# Altium schematic sheet USB2JTAG-MCU.SchDoc: =ProjectTitle+'-MCU'
size A4; SheetNumber: 2; SheetTotal: 3
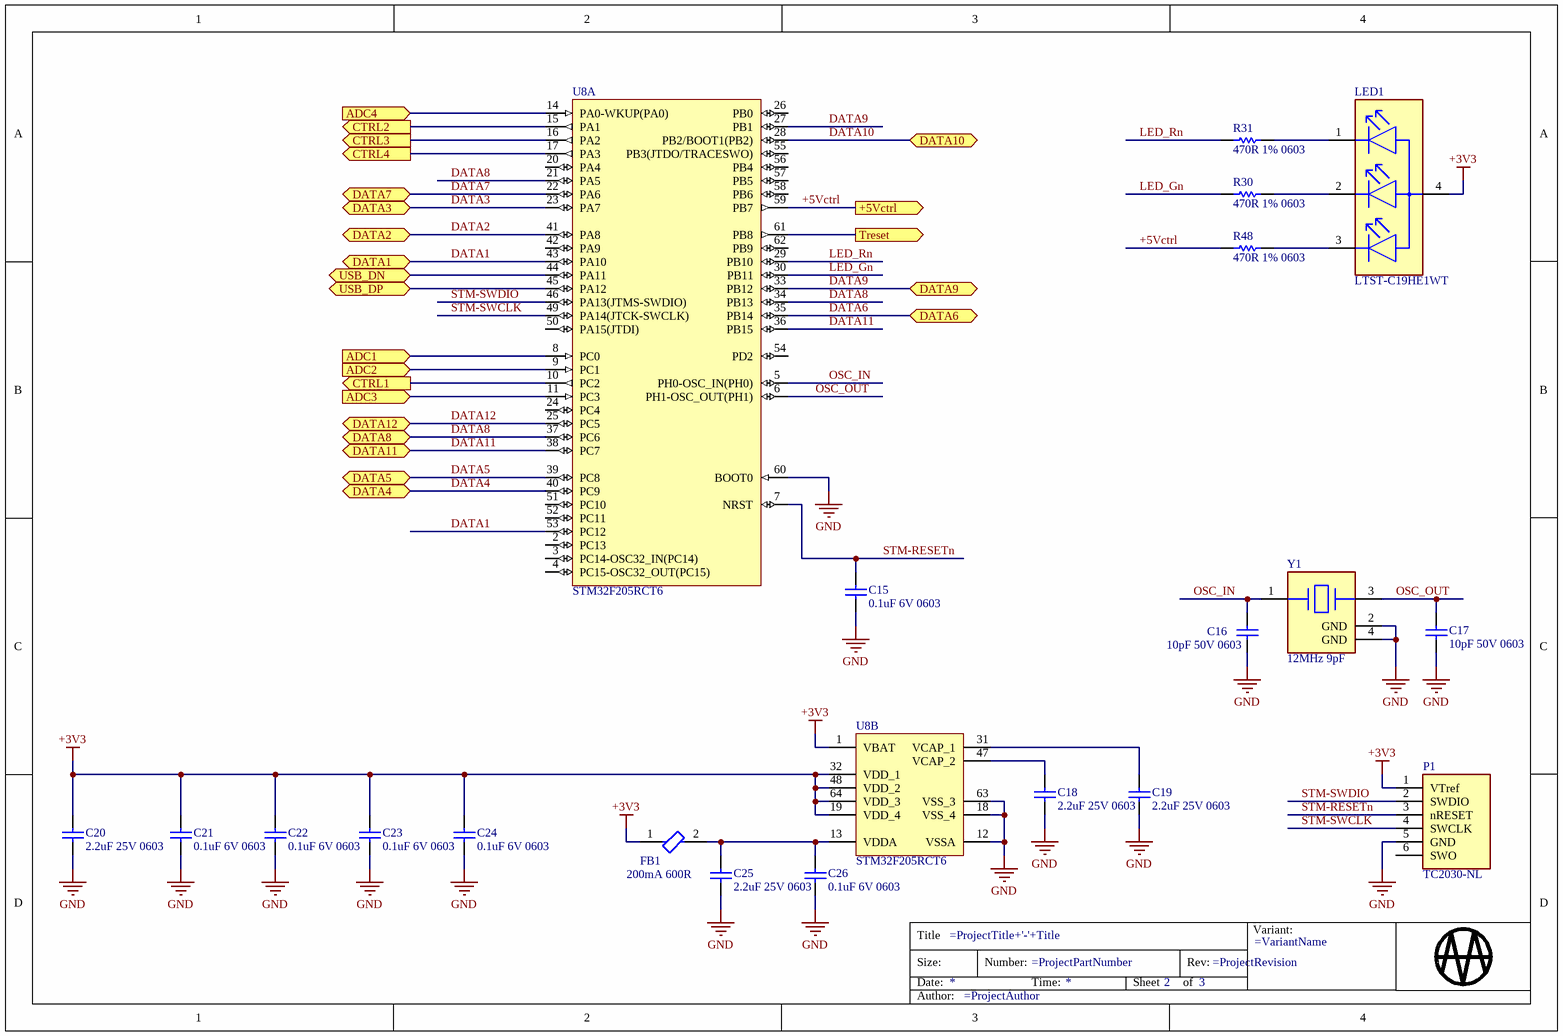
[diagram p0: USB2JTAG-MCU.SchDoc]

## Parts
?  Total Sheets: 3  Sheet Number: 2  (hidden comment: Title Block Logo)  (graphical)
C15  0.1uF 6V 0603  [FP-GRM188-0_1-e0_2_0_55-IPC_C-NOSILK]
C16  10pF 50V 0603  [FP-GRM188-0_1-e0_2_0_55-IPC_C-NOSILK]
C17  10pF 50V 0603  [FP-GRM188-0_1-e0_2_0_55-IPC_C-NOSILK]
C18  2.2uF 25V 0603  [FP-GRM188-0_1-e0_2_0_55-IPC_C-NOSILK]
C19  2.2uF 25V 0603  [FP-GRM188-0_1-e0_2_0_55-IPC_C-NOSILK]
C20  2.2uF 25V 0603  [FP-GRM188-0_1-e0_2_0_55-IPC_C-NOSILK]
C21  0.1uF 6V 0603  [FP-GRM188-0_1-e0_2_0_55-IPC_C-NOSILK]
C22  0.1uF 6V 0603  [FP-GRM188-0_1-e0_2_0_55-IPC_C-NOSILK]
C23  0.1uF 6V 0603  [FP-GRM188-0_1-e0_2_0_55-IPC_C-NOSILK]
C24  0.1uF 6V 0603  [FP-GRM188-0_1-e0_2_0_55-IPC_C-NOSILK]
C25  2.2uF 25V 0603  [FP-GRM188-0_1-e0_2_0_55-IPC_C-NOSILK]
C26  0.1uF 6V 0603  [FP-GRM188-0_1-e0_2_0_55-IPC_C-NOSILK]
FB1  200mA 600R  [FP-BLM18-0_15-t0_8-IPC_C]
LED1  LTST-C19HE1WT  [FP-LTST-C19HE1WT-MFG]
P1  TC2030-NL  [TC2030-NL]  (no BOM)
R30  470R 1% 0603  [FP-ERA3A-IPC_C-NOSILK]
R31  470R 1% 0603  [FP-ERA3A-IPC_C-NOSILK]
R48  470R 1% 0603  [FP-ERA3A-IPC_C-NOSILK]
U8  STM32F205RCT6  [STM-LQFP64_V]  (parts A,B of 2)
Y1  12MHz 9pF  [FP-TSX-3225-MFG]

## Ports
+5Vctrl (out), ADC1 (in), ADC2 (in), ADC3 (in), ADC4 (in), CTRL1 (out), CTRL2 (out), CTRL3 (out), CTRL4 (out), DATA1 (bidir), DATA2 (bidir), DATA3 (bidir), DATA4 (bidir), DATA5 (bidir), DATA6 (bidir), DATA7 (bidir), DATA8 (bidir), DATA9 (bidir), DATA10 (bidir), DATA11 (bidir), DATA12 (bidir), Treset (out), USB_DN (bidir), USB_DP (bidir)

## Nets
+3V3: C20.1 C21.1 C22.1 C23.1 C24.1 FB1.1 LED1.4(A) P1.1(VTref) U8.1(VBAT) U8.19(VDD_4) U8.32(VDD_1) U8.48(VDD_2) U8.64(VDD_3)
GND: C15.2 C16.2 C17.2 C18.2 C19.2 C20.2 C21.2 C22.2 C23.2 C24.2 C25.2 C26.2 P1.5(GND) U8.12(VSSA) U8.18(VSS_4) U8.60(BOOT0) U8.63(VSS_3) Y1.2(GND) Y1.4(GND)
+5Vctrl: R48.1 U8.59(PB7) ; port +5Vctrl
ADC1: U8.8(PC0) ; port ADC1
ADC2: U8.9(PC1) ; port ADC2
ADC3: U8.11(PC3) ; port ADC3
ADC4: U8.14(PA0-WKUP(PA0)) ; port ADC4
CTRL1: U8.10(PC2) ; port CTRL1
CTRL2: U8.15(PA1) ; port CTRL2
CTRL3: U8.16(PA2) ; port CTRL3
CTRL4: U8.17(PA3) ; port CTRL4
DATA1: U8.43(PA10) U8.53(PC12) ; port DATA1
DATA2: U8.41(PA8) ; port DATA2
DATA3: U8.23(PA7) ; port DATA3
DATA4: U8.40(PC9) ; port DATA4
DATA5: U8.39(PC8) ; port DATA5
DATA6: U8.35(PB14) ; port DATA6
DATA7: U8.22(PA6) ; port DATA7
DATA8: U8.21(PA5) U8.34(PB13) U8.37(PC6) ; port DATA8
DATA9: U8.27(PB1) U8.33(PB12) ; port DATA9
DATA10: U8.28(PB2/BOOT1(PB2)) ; port DATA10
DATA11: U8.36(PB15) U8.38(PC7) ; port DATA11
DATA12: U8.25(PC5) ; port DATA12
LED_Gn: R30.1 U8.30(PB11)
LED_Rn: R31.1 U8.29(PB10)
OSC_IN: C16.1 U8.5(PH0-OSC_IN(PH0)) Y1.1
OSC_OUT: C17.1 U8.6(PH1-OSC_OUT(PH1)) Y1.3
STM-RESETn: C15.1 P1.3(nRESET) U8.7(NRST)
STM-SWCLK: P1.4(SWCLK) U8.49(PA14(JTCK-SWCLK))
STM-SWDIO: P1.2(SWDIO) U8.46(PA13(JTMS-SWDIO))
Treset: U8.61(PB8) ; port Treset
USB_DN: U8.44(PA11) ; port USB_DN
USB_DP: U8.45(PA12) ; port USB_DP
NetC18_1: C18.1 U8.47(VCAP_2)
NetC19_1: C19.1 U8.31(VCAP_1)
NetC25_1: C25.1 C26.1 FB1.2 U8.13(VDDA)
NetLED1_1: LED1.1(RED_C) R31.2
NetLED1_2: LED1.2(GREEN_C) R30.2
NetLED1_3: LED1.3(BLUE_C) R48.2

Not connected (* = marked no-connect by the designer): P1 6(SWO); U8 2(PC13) 3(PC14-OSC32_IN(PC14)) 4(PC15-OSC32_OUT(PC15)) 20(PA4) 24(PC4) 26(PB0) 42(PA9) 50(PA15(JTDI)) 51(PC10) 52(PC11) 54(PD2) 55(PB3(JTDO/TRACESWO)) 56(PB4) 57(PB5) 58(PB6) 62(PB9)

## Notes on the sheet
- Title
- Size:
- Date:
- A4
- Number:
- Time:
- Revision:
- Sheet
- of
- File:
- (in symbol Title Block MAA) Variant:; Title; Size:; Number:; Rev:; Date:; Time:; Sheet; of; Author:

## Library data of the parts
? = Title Block MAA: Sheet Title: =ProjectTitle+'-'+Title; Document Number: =ProjectPartNumber; Revision Number: =ProjectRevision; Organization Address 1: =VariantName; Date: *; Time: *; Document Path and Name: =ProjectAuthor
C15 C21-C24 C26 = CAP0603: 50V 100nF X7R ±5% 0603 Multilayer Ceramic Capacitors MLCC - SMD/SMT ROHS; Manufacturer: Walsin Tech Corp; Manufacturer Part Number: 0603B104J500CT; Supplier 1: LCSC; Supplier Part Number 1: C119027; Case/Package: 0603
  C26: ComponentLink1Description: Datasheet; ComponentLink1URL: https://datasheet.lcsc.com/lcsc/1811151131_Walsin-Tech-Corp-0603B104J500CT_C119027.pdf
C16 C17 = CAP0603: 50V 10pF C0G ±5% 0603 Multilayer Ceramic Capacitors MLCC - SMD/SMT ROHS; Manufacturer: FH(Guangdong Fenghua Advanced Tech); Manufacturer Part Number: 0603CG100J500NT; Supplier 1: LCSC; Supplier Part Number 1: C91367; Case/Package: 0603
  C16: ComponentLink1Description: Datasheet; ComponentLink1URL: https://datasheet.lcsc.com/lcsc/1811061814_FH-Guangdong-Fenghua-Advanced-Tech-0603CG100J500NT_C91367.pdf
C18-C20 C25 = CAP0603: 25V 2.2uF X7R ±10% 0603 Multilayer Ceramic Capacitors MLCC - SMD/SMT ROHS; Manufacturer: FH(Guangdong Fenghua Advanced Tech); Manufacturer Part Number: 0603B225K250NT; Supplier 1: LCSC; Supplier Part Number 1: C99228; Case/Package: 0603
  C18 C25: ComponentLink1Description: Datasheet; ComponentLink1URL: https://datasheet.lcsc.com/lcsc/1810101210_FH-Guangdong-Fenghua-Advanced-Tech-0603B225K250NT_C99228.pdf
FB1 = CMP-0686-00557-7: 200mA 1 450mΩ 600Ω@100MHz ±25% 0603 Ferrite Beads ROHS; Manufacturer: Sunlord; Manufacturer Part Number: GZ1608D601TF; Supplier 1: LCSC; Supplier Part Number 1: C1002; Case/Package: 0603; ComponentLink1Description: Datasheet; ComponentLink1URL: https://datasheet.lcsc.com/lcsc/2109180930_Sunlord-GZ1608D601TF_C1002.pdf
LED1 = CMP-2000-05201-2: LED RGB DIFFUSED CHIP SMD; Manufacturer: Vishay Lite-On; Number of LEDs: 3; Test Current: 20mA; Luminous Intensity: 180mcd; Lens Color: White; Dominant Wavelength: 470nm; Color: Blue; Reverse Voltage: 5V; Viewing Angle: 130°; Forward Voltage: 3.35V; Max Operating Temperature: 80°C; Packaging: Tape and Reel; Lens Transparency: Diffused; Width: 1.6mm; Case Code (Metric): 1616; Height: 0.35mm; Lens Style: Diffused; Mount: Surface Mount; Package Quantity: 3000; Radiation Hardening: No; Length: 1.6mm; Case/Package: 0606; Forward Current: 20mA; Case Code (Imperial): 0606; Lead Free: Lead Free; Min Operating Temperature: -20°C; Number of Elements: 3; Number of Pins: 4; Depth: 1.6mm; Supplier 1: Rs; Supplier Part Number 1: C458749; Manufacturer Part Number: LTST-C19HE1WT; RoHS: Yes; Category: LEDs; Stock 1: 9250; Pricing 1: 5=138,483, 10=79,328 (RUB); Series: -; RoHS Compliant: Yes; ComponentLink1URL: https://datasheet.ciiva.com/41805/s-110-ltst-c19he1wt-41805918.pdf?src-supplier=Digi-Key; ComponentLink1Description: https://datasheet.ciiva.com/41805/s-110-ltst-c19he1wt-41805918.pdf?src-supplier=Digi-Key; ComponentLink2URL: https://datasheet.ciiva.com/11773/0900766b80dc0566-11773828.pdf?src-supplier=Rs; ComponentLink2Description: https://datasheet.ciiva.com/11773/0900766b80dc0566-11773828.pdf?src-supplier=Rs
R30 R31 R48 = RES0603: 100mW 75V ±100ppm/℃ ±1% -55℃~+155℃ 470Ω 0603 Chip Resistor - Surface Mount ROHS; Manufacturer: YAGEO; Manufacturer Part Number: RC0603FR-07470RL; Case/Package: 0603; Supplier 1: LCSC; Supplier Part Number 1: C114669
U8 = STM32F205RCT6: High-performance ARM Cortex-M3 MCU with 256 Kbytes Flash, 120 MHz CPU, ART Accelerator; Manufacturer: STMicroelectronics; RAM Size: 100KB; Max Power Dissipation: 444mW; Interface: SDIO,I2C,SPI,USB,CAN,IrDA,MMC,UART,USART,LIN,I2S; Number of I/Os: 51; Number of Timers/Counters: 14; Max Supply Voltage: 3.6V; Frequency: 120MHz; Min Supply Voltage: 1.8V; Number of Programmable I/O: 16; Data Bus Width: 32b; Oscillator Type: Internal; Watchdog Timer: Yes; Memory Size: 256KB; Peripherals: Brown-out Detect/Reset,POR,PWM,WDT,DMA,LCD,I2C; Number of PWM Channels: 2; Number of SPI Channels: 3; Number of Ethernet Channels: 1; ComponentLink2URL: http://www.st.com/st-web-ui/static/active/en/resource/technical/document/datasheet/CD00237391.pdf; ComponentLink3Description: Package Specification; ComponentLink2Description: Datasheet; ComponentLink1Description: Manufacturer URL; ComponentLink3URL: http://www.st.com/st-web-ui/static/active/en/resource/technical/document/datasheet/DM00037051.pdf; ComponentLink1URL: http://www.st.com/web/en/home.html; Supplier 1: RSComponents; Manufacturer Part Number: STM32F205RCT6; RoHS: Yes; Category: Microcontrollers; Stock 1: 3; Pricing 1: 5=12,81000, 10=11,58000, 25=11,05600, 100=9,59400, 250=9,13400 (GBP); Case/Package: LQFP; Number of Pins: 64; Min Operating Temperature: -40°C; Max Operating Temperature: 85°C; Packaging: Tray; Max Frequency: 120MHz; Memory Type: FLASH; Core Architecture: ARM; Package Quantity: 160; Number of USB Channels: 2; Number of ADC Channels: 16; Number of I2C Channels: 3; Number of UART Channels: 2; Length: 10.2mm; Width: 10.2mm; Height: 1.45mm; Radiation Hardening: No; REACH SVHC: No SVHC; Lead Free: Lead Free; ComponentLink4URL: https://datasheet.ciiva.com/8055/1776949-8055000.pdf?src-supplier=Element14; ComponentLink4Description: https://datasheet.ciiva.com/8055/1776949-8055000.pdf?src-supplier=Element14; ComponentLink5URL: https://datasheet.ciiva.com/16491/cd00237391-16491001.pdf?src-supplier=Future+Electronics; ComponentLink5Description: https://datasheet.ciiva.com/16491/cd00237391-16491001.pdf?src-supplier=Future+Electronics; ComponentLink6URL: https://datasheet.ciiva.com/48687/001075498-da-01-en-mcu-256kb-stm32f205rct6-lqfp-64-stm-48687468.pdf?src-supplier=Conrad; ComponentLink6Description: https://datasheet.ciiva.com/48687/001075498-da-01-en-mcu-256kb-stm32f205rct6-lqfp-64-stm-48687468.pdf?src-supplier=Conrad; Supplier Part Number 1: 7958647
Y1 = CMP-36405-000013-1: SMD3225-4P Crystals ROHS; Manufacturer: TAE(Zhejiang Abel Elec); Manufacturer Part Number: TXM12M0004322CBCDO00T; ESR (Equivalent Series Resistance): 60R; Load Capacitance: 9pF; Frequency: 12MHz; Case/Package: SMD3225-4P; Supplier 1: LCSC; Supplier Part Number 1: C362368; Category: Crystals; ComponentLink1Description: Datasheet; ComponentLink1URL: https://datasheet.lcsc.com/lcsc/1912111437_TAE-Zhejiang-Abel-Elec-TXM12M0004322CBCDO00T_C362368.pdf